# EasyEDA Pro project 无线充电接收线圈.epro

# Schematic Schematic1
Board Name: Board1; Create Date: 2025-05-09
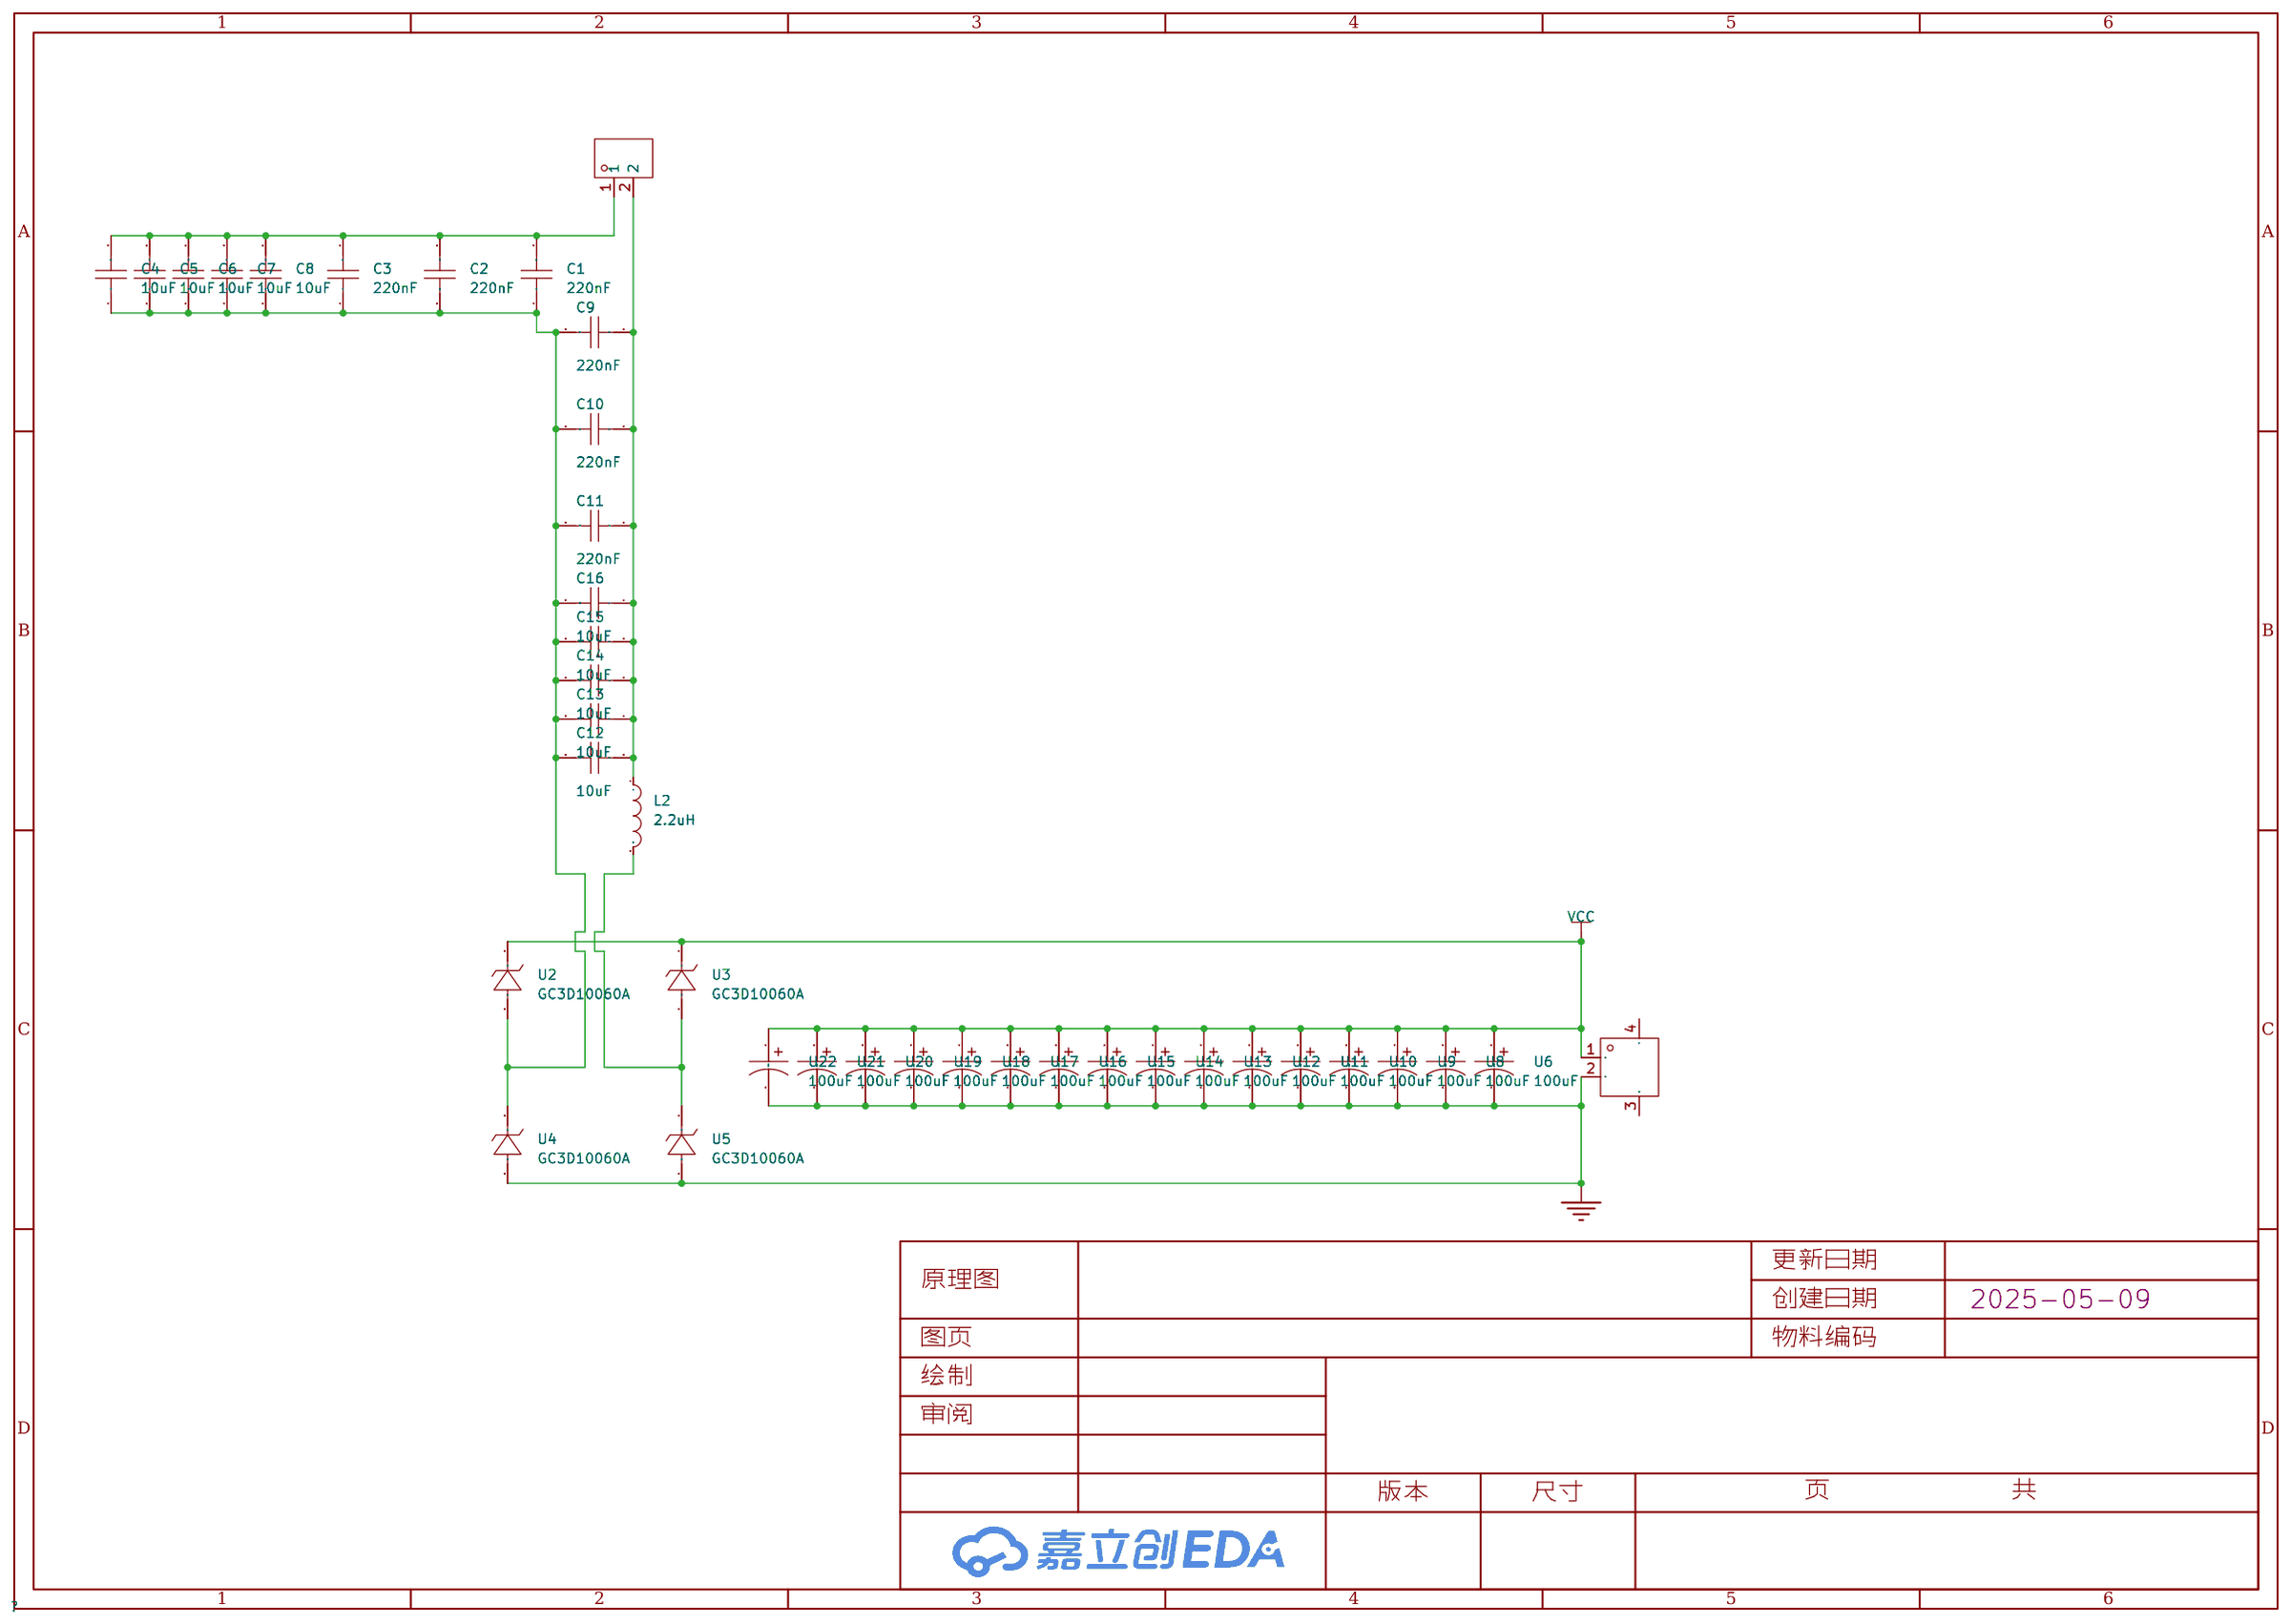
[diagram p0: schematic sheet]

## Parts
C1  220nF  [CAP-TH_L12.0-W6.5-P10.00-D1.0]
C2  220nF  [CAP-TH_L12.0-W6.5-P10.00-D1.0]
C3  220nF  [CAP-TH_L12.0-W6.5-P10.00-D1.0]
C4  10uF  [C1206]
C5  10uF  [C1206]
C6  10uF  [C1206]
C7  10uF  [C1206]
C8  10uF  [C1206]
C9  220nF  [CAP-TH_L12.0-W6.5-P10.00-D1.0]
C10  220nF  [CAP-TH_L12.0-W6.5-P10.00-D1.0]
C11  220nF  [CAP-TH_L12.0-W6.5-P10.00-D1.0]
C12  10uF  [C1206]
C13  10uF  [C1206]
C14  10uF  [C1206]
C15  10uF  [C1206]
C16  10uF  [C1206]
CN1  XT30U-M  [CONN-TH_XT30U-M]
L2  2.2uH  [IND-SMD_L11.0-W10.0]
U1  XT30PW-F20.G.Y  [CONN-TH_XT30PW-F-1]
U2  GC3D10060A  [TO-220-2_L10.2-W4.5-P5.08-L-A]
U3  GC3D10060A  [TO-220-2_L10.2-W4.5-P5.08-L-A]
U4  GC3D10060A  [TO-220-2_L10.2-W4.5-P5.08-L-A]
U5  GC3D10060A  [TO-220-2_L10.2-W4.5-P5.08-L-A]
U6  100uF  [CAP-TH_BD10.0-P5.00-D0.6-FD]
U8  100uF  [CAP-TH_BD10.0-P5.00-D0.6-FD]
U9  100uF  [CAP-TH_BD10.0-P5.00-D0.6-FD]
U10  100uF  [CAP-TH_BD10.0-P5.00-D0.6-FD]
U11  100uF  [CAP-TH_BD10.0-P5.00-D0.6-FD]
U12  100uF  [CAP-TH_BD10.0-P5.00-D0.6-FD]
U13  100uF  [CAP-TH_BD10.0-P5.00-D0.6-FD]
U14  100uF  [CAP-TH_BD10.0-P5.00-D0.6-FD]
U15  100uF  [CAP-TH_BD10.0-P5.00-D0.6-FD]
U16  100uF  [CAP-TH_BD10.0-P5.00-D0.6-FD]
U17  100uF  [CAP-TH_BD10.0-P5.00-D0.6-FD]
U18  100uF  [CAP-TH_BD10.0-P5.00-D0.6-FD]
U19  100uF  [CAP-TH_BD10.0-P5.00-D0.6-FD]
U20  100uF  [CAP-TH_BD10.0-P5.00-D0.6-FD]
U21  100uF  [CAP-TH_BD10.0-P5.00-D0.6-FD]
U22  100uF  [CAP-TH_BD10.0-P5.00-D0.6-FD]

## Library data of the parts
C1-C3 C9-C11 = MPP224J2J10NN22600: 容值:220nF;精度:±5%;额定电压:630V;工作温度:-40℃~+105℃;; LCSC Part Name: 220nF ±5% 630V; Supplier Part: C506861; Manufacturer: KNSCHA(科尼盛); Supplier Footprint: 插件,P=10mm; JLCPCB Part Class: 扩展库; Datasheet: https://atta.szlcsc.com/upload/public/pdf/source/20240529/DB3146B803AF510728C1C78D9C728D2A.pdf; Supplier: LCSC; Tolerance: ±5%; Voltage Rating: 630V; Operating Temperature: -40℃~+105℃
C4-C8 C12-C16 = HGC1206R5106K500NSPJ: 容值:10uF;精度:±10%;额定电压:50V;温度系数:X5R;; LCSC Part Name: 10uF ±10% 50V; Supplier Part: C7432781; Manufacturer: Chinocera(华瓷); Supplier Footprint: 1206; JLCPCB Part Class: 扩展库; Datasheet: https://atta.szlcsc.com/upload/public/pdf/source/20240320/FAC3FEC40A78BC5CCCE96C232A94D860.pdf; Supplier: LCSC; Tolerance: ±10%; Voltage Rating: 50V; Temperature Coefficient: X5R
CN1 = XT30U-M: 类别:-;类型1:-;; LCSC Part Name: AMASS(艾迈斯)轻量版锂电池插头公头 XT30U-M; Supplier Part: C99101; Manufacturer: AMASS(艾迈斯); JLCPCB Part Class: 扩展库; Datasheet: https://atta.szlcsc.com/upload/public/pdf/source/20170606/1496716542582.pdf; Supplier: LCSC; Brand: 艾迈斯; Type: 插头; Colour: 黄色; InterfaceType: 公头
L2 = CXP1050-2R2M-AG(2.2uh): 电感值:2.2uH;精度:±20%;额定电流:13A;饱和电流(Isat):20A;类型:一体成型电感;; LCSC Part Name: 2.2uH ±20% 20A; Supplier Part: C7461387; Manufacturer: DMBJ(振宝佳); Supplier Footprint: 1050; JLCPCB Part Class: 扩展库; Datasheet: https://atta.szlcsc.com/upload/public/pdf/source/20230706/7F3A5B39C5AD80A91C9FA782B54A296B.pdf; Supplier: LCSC; Tolerance: ±20%; Current Rating: 13A; Current - Saturation(Isat): 20A; DC Resistance(DCR): 6.5mΩ; Type: 一体成型电感
U1 = XT30PW-F20.G.Y: 类别:-;类型1:-;; LCSC Part Name: AMASS(艾迈斯)电源连接器 母头 XT30PW-F; Supplier Part: C2913282; Manufacturer: AMASS(艾迈斯); JLCPCB Part Class: 扩展库; Datasheet: https://atta.szlcsc.com/upload/public/pdf/source/20231218/06CFCF98887A9A87638B0856A725C8FD.pdf; Supplier: LCSC; Type: 航模插头; InterfaceType: 母头
U2-U5 = GC3D10060A: 整流电流:30A;正向压降(Vf):1.5V;直流反向耐压(Vr):600V;; Supplier Part: C7435067; Manufacturer: SUPSiC(国晶微半导体); Supplier Footprint: TO-220-2; JLCPCB Part Class: 扩展库; Datasheet: https://atta.szlcsc.com/upload/public/pdf/source/20250205/3695CF15F3279325270CAD500C1B9FA8.pdf; Supplier: LCSC; Current - Rectified: 30A; Voltage - Forward(Vf@If): 1.5V; Voltage - DC Reverse(Vr): 600V
U6 U8-U22 = 01EC0961: 容值:100uF;精度:±20%;额定电压:100V;纹波电流:420mA@100kHz;等效串联电阻(ESR):420mΩ@100kHz;; LCSC Part Name: 100uF ±20% 100V; Supplier Part: C2831792; Manufacturer: KNSCHA(科尼盛); Supplier Footprint: 插件,D10xL16mm; JLCPCB Part Class: 扩展库; Datasheet: https://atta.szlcsc.com/upload/public/pdf/source/20210511/C2831792_495F9A8D184F04ABB2BF32BD0A8B2523.pdf; Supplier: LCSC; Tolerance: ±20%; Voltage Rating: 100V; Ripple Current: 420mA@100kHz; Equivalent Series Resistance(ESR): 420mΩ@100kHz; Pin Spacing: 5mm; Diameter: 10mm; Height - Seated (Max): 16mm; Lifetime: 10000hrs@105℃; Operating Temperature: -55℃~+105℃

## Nets
GND: U1.2 U4.3(A) U5.3(A) U6.2 U8.2 U9.2 U10.2 U11.2 U12.2 U13.2 U14.2 U15.2 U16.2 U17.2 U18.2 U19.2 U20.2 U21.2 U22.2
VCC: U1.1 U2.1(K) U3.1(K) U6.1 U8.1 U9.1 U10.1 U11.1 U12.1 U13.1 U14.1 U15.1 U16.1 U17.1 U18.1 U19.1 U20.1 U21.1 U22.1
$1N888: C1.1 C2.1 C3.1 C4.1 C5.1 C6.1 C7.1 C8.1 C9.2 C10.2 C11.2 C12.2 C13.2 C14.2 C15.2 C16.2 U2.3(A) U4.1(K)
$1N903: L2.2 U3.3(A) U5.1(K)
$1N1181: C1.2 C2.2 C3.2 C4.2 C5.2 C6.2 C7.2 C8.2 CN1.1
$1N1768: C9.1 C10.1 C11.1 C12.1 C13.1 C14.1 C15.1 C16.1 CN1.2 L2.1

Not connected (* = marked no-connect by the designer): U1 3 4

# Board PCB1
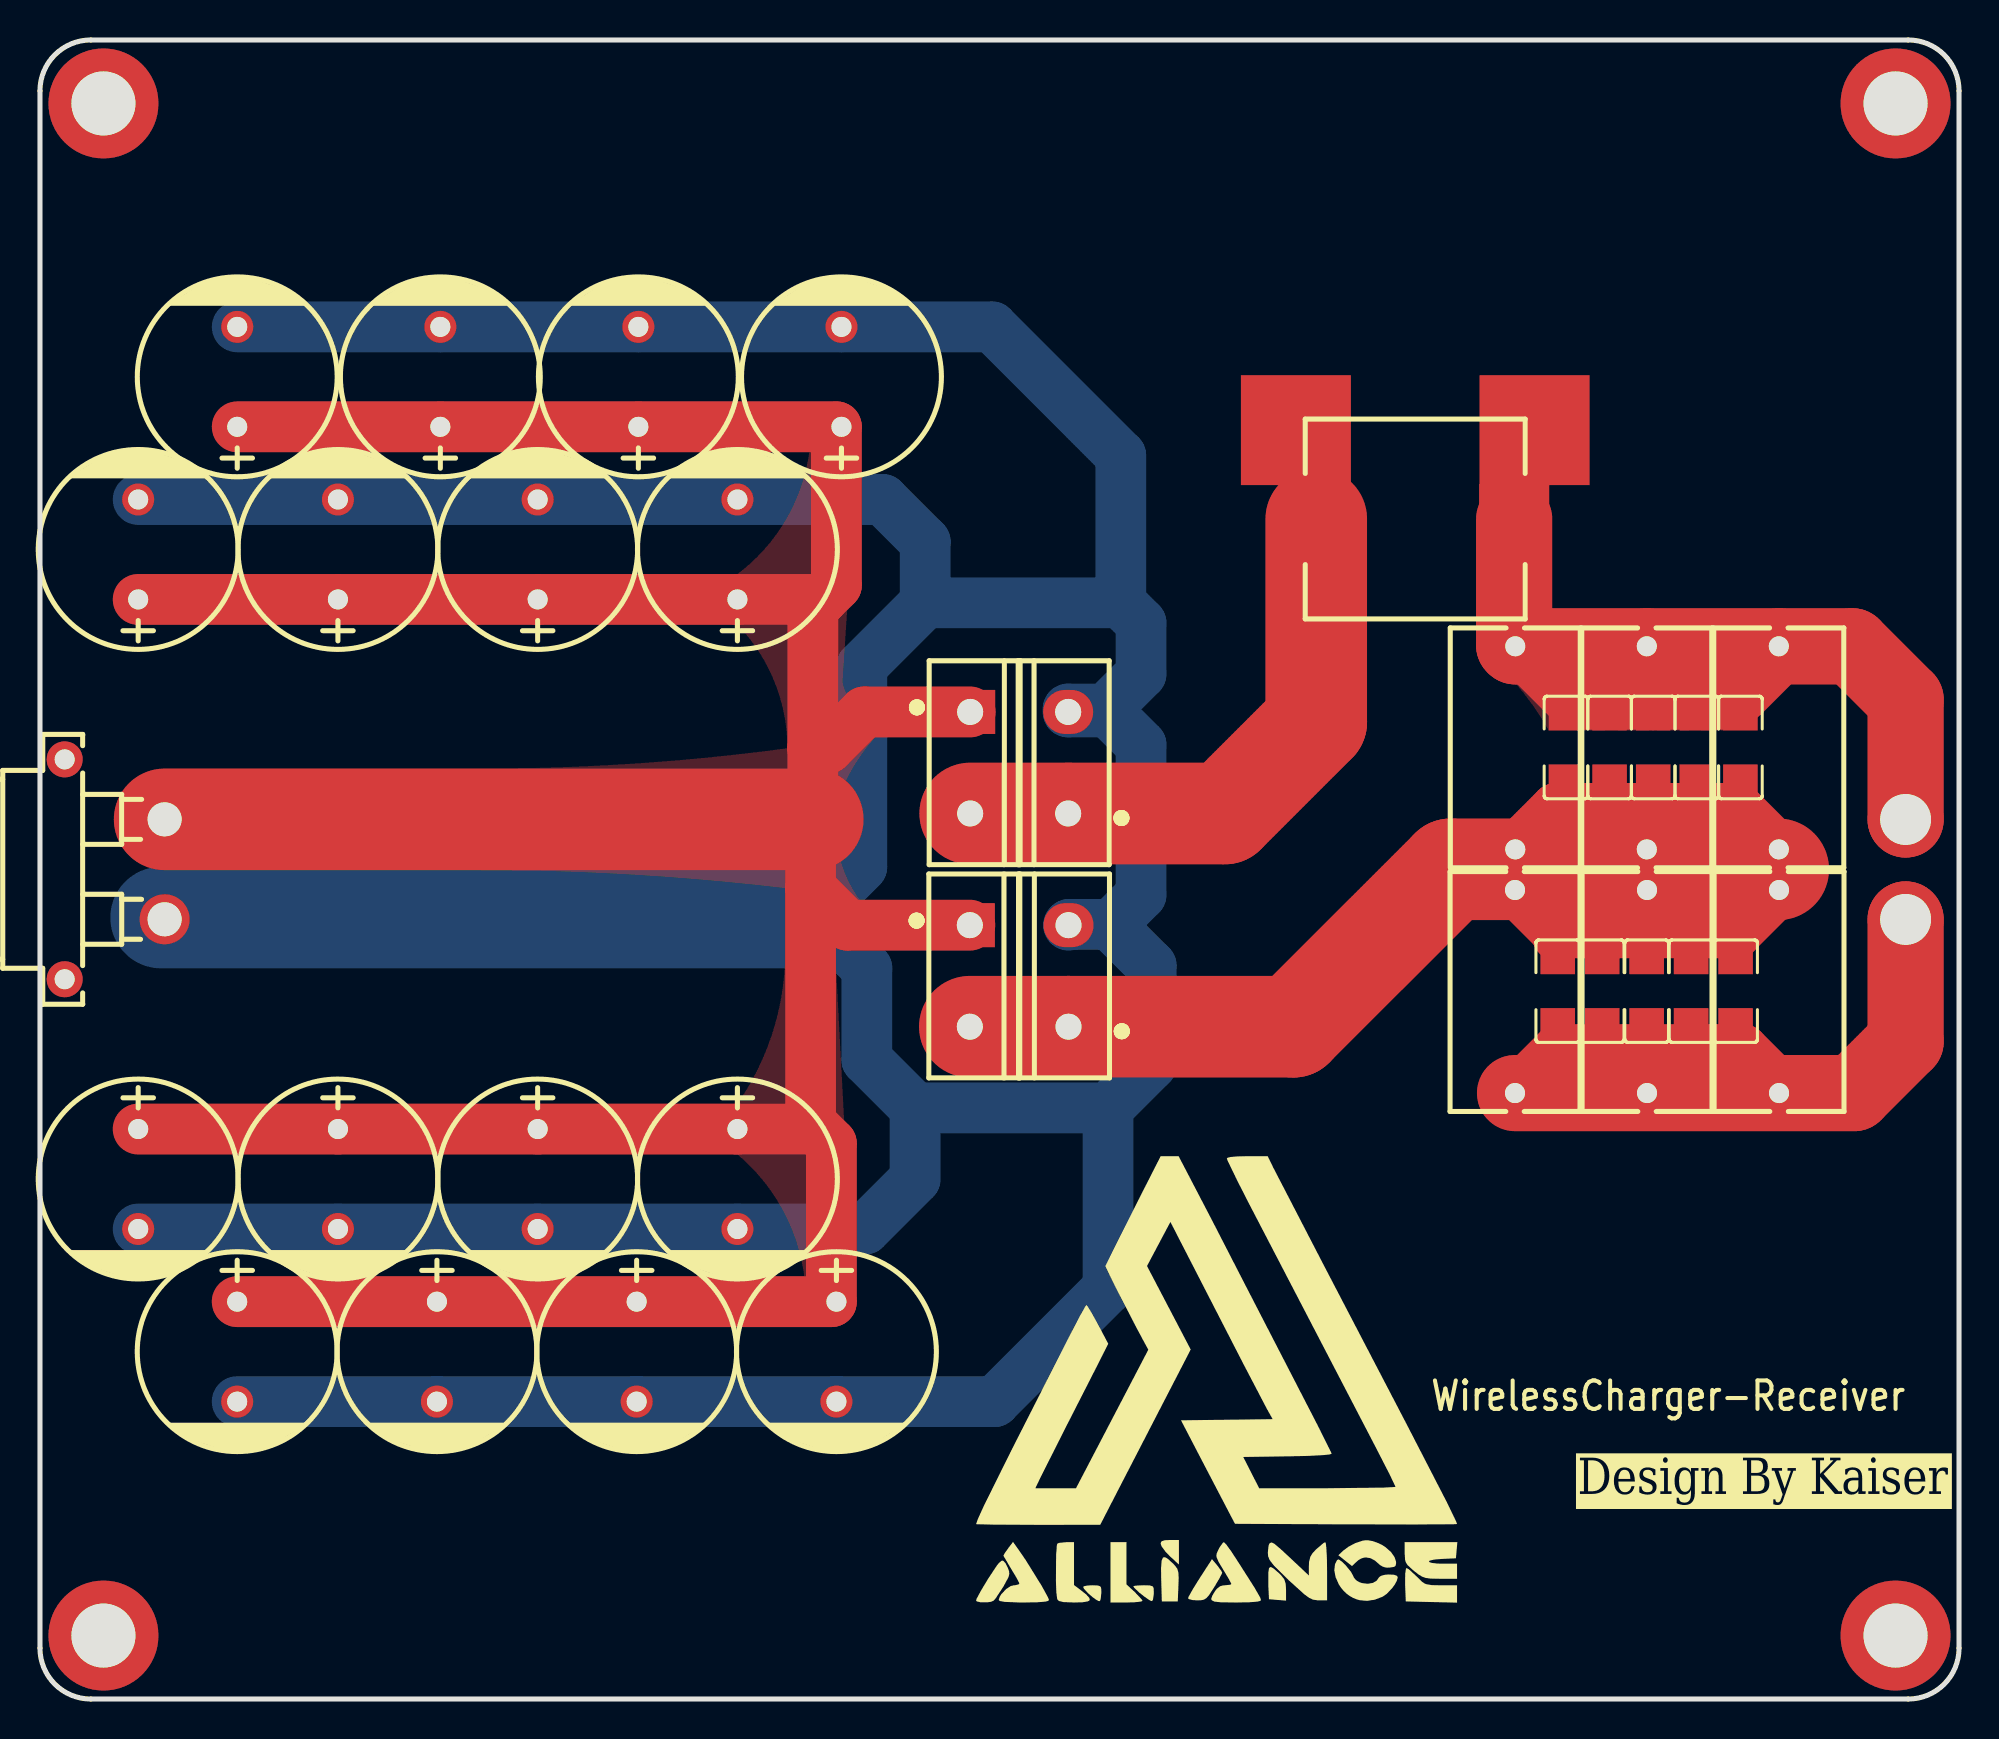
[diagram p1: board, top side]
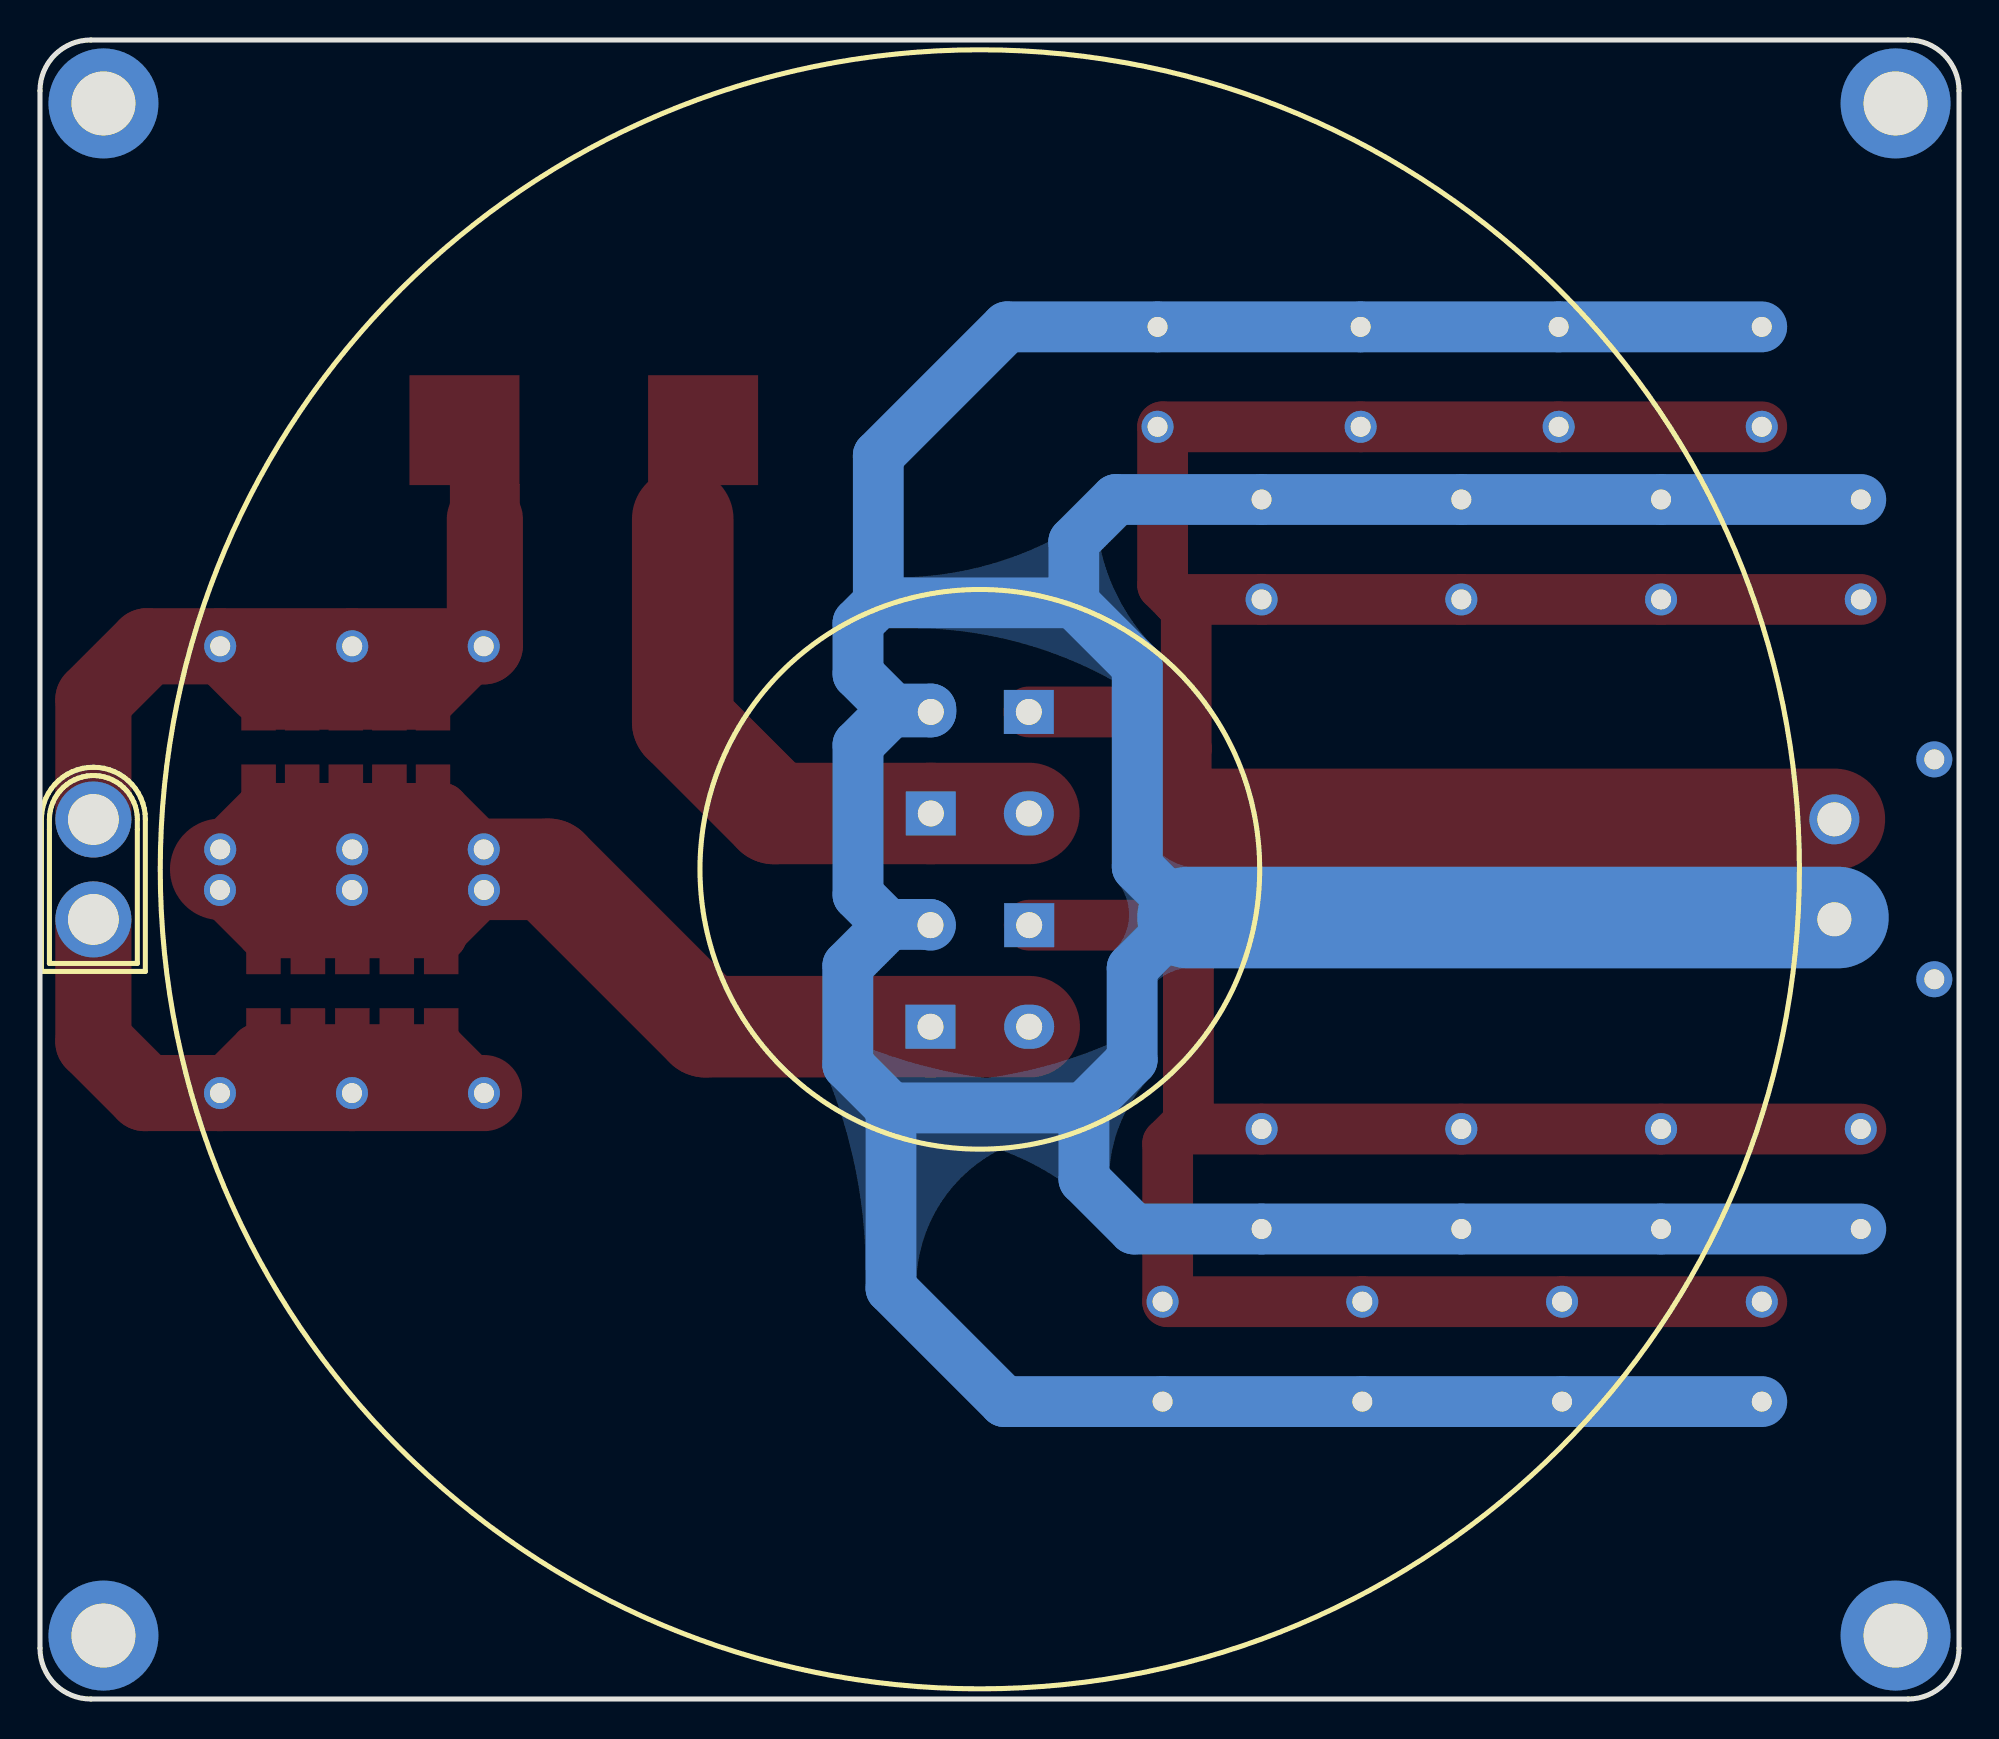
[diagram p2: board, bottom side, seen from below]

Outline 96 x 83 mm; copper layers: Top Layer, Bottom Layer. Coordinates in mm from the lower left corner of the outline.
Outline path: 0,80.46 0,2.54 arc(0.74,0.74) 2.54,0 93.46,0 arc(95.26,0.74) 96,2.54 96,80.46 arc(95.26,82.26) 93.46,83 2.54,83 arc(0.74,82.26) 0,80.46
Stack: Top Layer 0.035mm / Dielectric1 1.51mm FR4 er 4.5 / Bottom Layer 0.035mm

## Design rules (mm)
template: JLCPCB Capability(Two Layers Board)
spacing copperThickness1oz (default): track to track 0.102, other pairs 0.152 to 0.3
spacing copperThickness2oz: track to track 0.203, other pairs 0.152 to 0.3
track width copperThickness1oz (default): min 0.127, default 0.254, max 2.54
track width copperThickness2oz: min 0.203, default 0.254, max 2.54
differential pair differentialPair (default): width min 0.127, default 0.254, max 2.54; gap min 0.152, default 0.152
via viaSize (default): diameter min 0.5, default 0.61, max 10; hole min 0.3, default 0.305, max 6.3

## Placement (name value [footprint] x y rotation side)
C1  220nF  [CAP-TH_L12.0-W6.5-P10.00-D1.0]  73.79 35.39 270 top
C2  220nF  [CAP-TH_L12.0-W6.5-P10.00-D1.0]  80.39 35.39 270 top
C3  220nF  [CAP-TH_L12.0-W6.5-P10.00-D1.0]  87 35.39 270 top
C4  10uF  [C1206]  84.82 35.41 270 top
C5  10uF  [C1206]  82.6 35.41 270 top
C6  10uF  [C1206]  80.37 35.41 270 top
C7  10uF  [C1206]  78.15 35.41 270 top
C8  10uF  [C1206]  75.93 35.41 270 top
C9  220nF  [CAP-TH_L12.0-W6.5-P10.00-D1.0]  86.98 47.59 270 top
C10  220nF  [CAP-TH_L12.0-W6.5-P10.00-D1.0]  80.38 47.59 270 top
C11  220nF  [CAP-TH_L12.0-W6.5-P10.00-D1.0]  73.8 47.59 270 top
C12  10uF  [C1206]  76.34 47.6 270 top
C13  10uF  [C1206]  78.52 47.6 270 top
C14  10uF  [C1206]  80.7 47.6 270 top
C15  10uF  [C1206]  82.88 47.6 270 top
C16  10uF  [C1206]  85.06 47.6 270 top
CN1  XT30U-M  [CONN-TH_XT30U-M]  93.33 41.5 90 bottom
L2  2.2uH  [IND-SMD_L11.0-W10.0]  68.8 59.03 180 top
NOREF  -  [Pad_e44]  3.17 79.82 0 top
NOREF#2  -  [Pad_e42]  92.83 79.82 0 top
NOREF#3  -  [Pad_e628]  74.77 63.48 0 top
NOREF#4  -  [Pad_e45]  3.17 3.17 0 top
NOREF#5  -  [Pad_e46]  92.83 3.17 0 top
NOREF#6  -  [Pad_e624]  62.83 63.48 0 top
U1  XT30PW-F20.G.Y  [CONN-TH_XT30PW-F-1]  3.74 41.51 270 top
U2  GC3D10060A  [TO-220-2_L10.2-W4.5-P5.08-L-A]  46.52 36.17 270 top
U3  GC3D10060A  [TO-220-2_L10.2-W4.5-P5.08-L-A]  46.53 46.84 270 top
U4  GC3D10060A  [TO-220-2_L10.2-W4.5-P5.08-L-A]  51.45 36.17 90 top
U5  GC3D10060A  [TO-220-2_L10.2-W4.5-P5.08-L-A]  51.44 46.84 90 top
U6  100uF  [CAP-TH_BD10.0-P5.00-D0.6-FD]  34.89 57.51 90 top
U8  100uF  [CAP-TH_BD10.0-P5.00-D0.6-FD]  24.9 57.51 90 top
U9  100uF  [CAP-TH_BD10.0-P5.00-D0.6-FD]  14.91 57.51 90 top
U10  100uF  [CAP-TH_BD10.0-P5.00-D0.6-FD]  4.91 57.51 90 top
U11  100uF  [CAP-TH_BD10.0-P5.00-D0.6-FD]  20.03 66.15 90 top
U12  100uF  [CAP-TH_BD10.0-P5.00-D0.6-FD]  9.87 66.15 90 top
U13  100uF  [CAP-TH_BD10.0-P5.00-D0.6-FD]  34.89 26.01 270 top
U14  100uF  [CAP-TH_BD10.0-P5.00-D0.6-FD]  24.9 26.01 270 top
U15  100uF  [CAP-TH_BD10.0-P5.00-D0.6-FD]  14.91 26.01 270 top
U16  100uF  [CAP-TH_BD10.0-P5.00-D0.6-FD]  4.91 26.01 270 top
U17  100uF  [CAP-TH_BD10.0-P5.00-D0.6-FD]  39.84 17.38 270 top
U18  100uF  [CAP-TH_BD10.0-P5.00-D0.6-FD]  29.85 17.38 270 top
U19  100uF  [CAP-TH_BD10.0-P5.00-D0.6-FD]  19.86 17.38 270 top
U20  100uF  [CAP-TH_BD10.0-P5.00-D0.6-FD]  9.87 17.38 270 top
U21  100uF  [CAP-TH_BD10.0-P5.00-D0.6-FD]  40.09 66.15 90 top
U22  100uF  [CAP-TH_BD10.0-P5.00-D0.6-FD]  29.93 66.15 90 top

## Footprints (pads in the part's own frame, mm; a bottom-side part is the same pattern mirrored in y, then rotated)
C1206
  rect 1.485x1.728 smd: 1(-1.593,0) 2(1.593,0)
CAP-TH_BD10.0-P5.00-D0.6-FD
  round 1.6 hole 1: 1(-2.5,0) 2(2.5,0)
CAP-TH_L12.0-W6.5-P10.00-D1.0
  round 1.6 hole 1: 1(-5.08,0) 2(5.08,0)
CONN-TH_XT30PW-F-1
  round 2.5 hole 1.7: 1(-2.5,2.5) 2(2.5,2.5)
  round 1.8 hole 1: 3(5.5,-2.5) 4(-5.5,-2.5)
CONN-TH_XT30U-M
  round 3.8 hole 2.54: 1(-2.5,0) 2(2.5,0)
IND-SMD_L11.0-W10.0
  rect 3.5x3.5 smd: 1(-4.95,0) 2(4.95,0)
Pad_e42
  round 5.5 hole 3.2: 1(0,0)
Pad_e44
  round 5.5 hole 3.2: 1(0,0)
Pad_e45
  round 5.5 hole 3.2: 1(0,0)
Pad_e46
  round 5.5 hole 3.2: 1(0,0)
Pad_e624
  rect 5.5x5.5 smd: 1(0,0)
Pad_e628
  rect 5.5x5.5 smd: 1(0,0)
TO-220-2_L10.2-W4.5-P5.08-L-A
  rect 2.2x2.5 hole 1.3: 1(-2.54,0)
  oval 2.2x2.5 hole 1.3: 3(2.54,0)

## Nets
GND: U1.2 U4.3 U5.3 U6.2 U8.2 U9.2 U10.2 U11.2 U12.2 U13.2 U14.2 U15.2 U16.2 U17.2 U18.2 U19.2 U20.2 U21.2 U22.2
VCC: U1.1 U2.1 U3.1 U6.1 U8.1 U9.1 U10.1 U11.1 U12.1 U13.1 U14.1 U15.1 U16.1 U17.1 U18.1 U19.1 U20.1 U21.1 U22.1
$1N888: C1.1 C2.1 C3.1 C4.1 C5.1 C6.1 C7.1 C8.1 C9.2 C10.2 C11.2 C12.2 C13.2 C14.2 C15.2 C16.2 U2.3 U4.1
$1N903: L2.2 NOREF#6.1 U3.3 U5.1
$1N1181: C1.2 C2.2 C3.2 C4.2 C5.2 C6.2 C7.2 C8.2 CN1.1
$1N1768: C9.1 C10.1 C11.1 C12.1 C13.1 C14.1 C15.1 C16.1 CN1.2 L2.1 NOREF#3.1

Pads without a net: NOREF 1; NOREF#2 1; NOREF#4 1; NOREF#5 1; U1 3 4

## Routing (per net, layer and track width the routed paths; a pad name or vN(x,y) marks a point on that pad's centre or on a via; arc(x,y) is an arc through that point)
GND: length 313.7
  Bottom Layer w2.54: 53.56,38.71 53.52,38.75 51.49,38.75 U4.3 ; 53.56,38.71 55.59,36.68 55.59,31.73 53.43,29.57 ; 53.56,38.71 55.08,40.24 55.08,47.73 53.43,49.38 ; 53.43,29.57 53.43,20.55 47.75,14.88 U17.2 U18.2 U19.2 U20.2 ; 53.43,29.57 43.78,29.57 ; 44.28,54.84 44.28,57.89 42.17,60.01 U6.2 U8.2 U9.2 U10.2 ; 44.28,54.84 54.06,54.84 ; 44.28,54.84 41.11,51.67 41.11,41.64 38.57,39.1 38.82,39.1 41.36,36.56 41.36,31.98 43.78,29.57 ; 54.06,54.84 54.06,62.21 47.63,68.65 U21.2 U22.2 U11.2 U12.2 ; 54.06,54.84 55.08,53.83 55.08,51.29 53.3,49.51 ; 53.3,49.51 53.43,49.38 ; 53.3,49.51 53.28,49.53 51.44,49.53 U5.3 53.17,49.38 ; 53.3,49.51 53.17,49.38 ; 53.43,49.38 53.17,49.38 ; 43.78,29.57 43.78,26.01 41.28,23.51 U13.2 U14.2 U15.2 U16.2
  Bottom Layer w5.08: 6.06,39.1 38.57,39.1
VCC: length 222.4
  Top Layer w2.54: 38.55,40.57 40.4,38.71 U2.1 ; 38.55,40.57 38.55,43.9 38.66,44.01 38.66,47.57 ; 38.55,40.57 38.55,28.83 ; U3.1 41.24,49.38 39.42,47.57 38.66,47.57 ; U20.1 U19.1 U18.1 39.59,19.88 39.59,27.79 38.55,28.83 ; 38.66,47.57 38.66,54.55 39.12,55.01 ; 38.55,28.83 38.55,28.51 U13.1 U14.1 U15.1 U16.1 ; 39.12,55.01 39.84,55.73 39.84,63.65 U22.1 U11.1 U12.1 ; 39.12,55.01 U6.1 U8.1 U9.1 U10.1
  Top Layer w5.08: U1.1 38.66,44.01
$1N888: length 73.8
  Top Layer w2.54: C9.2 84.93,44.56 75.85,44.56 C11.2 ; C1.1 75.91,38.36 75.91,38.21 76.03,38.33 84.86,38.33 C3.1
  Top Layer w5.08: 86.96,41.51 70.57,41.51 62.7,33.63 U4.1 U2.3
$1N903: length 29.4
  Top Layer w5.08: L2.2 63.85,48.88 59.27,44.3 U5.1 U3.3
$1N1181: length 40.6
  Top Layer w2.54: C1.2 75.97,32.49 85.18,32.49 86.32,31.35
  Top Layer w3.81: C1.2 C2.2 C3.2 90.75,30.31 93.33,32.89 CN1.1
$1N1768: length 48.4
  Top Layer w2.54: C9.1 86.98,51.95 85.18,50.14 ; C11.1 76.7,49.76 84.67,49.76
  Top Layer w3.81: L2.1 73.75,52.72 C11.1 C10.1 C9.1 90.66,52.67 93.33,50 CN1.2

Small or netless copper shapes (teardrops, artwork), in the pictures only: 14 on Top Layer, 6 on Bottom Layer

## Text on the board
Top Silkscreen Layer: WirelessCharger-Receiver | Design By Kaiser
